# EAGLE design slider (EAGLE 9.5.2)
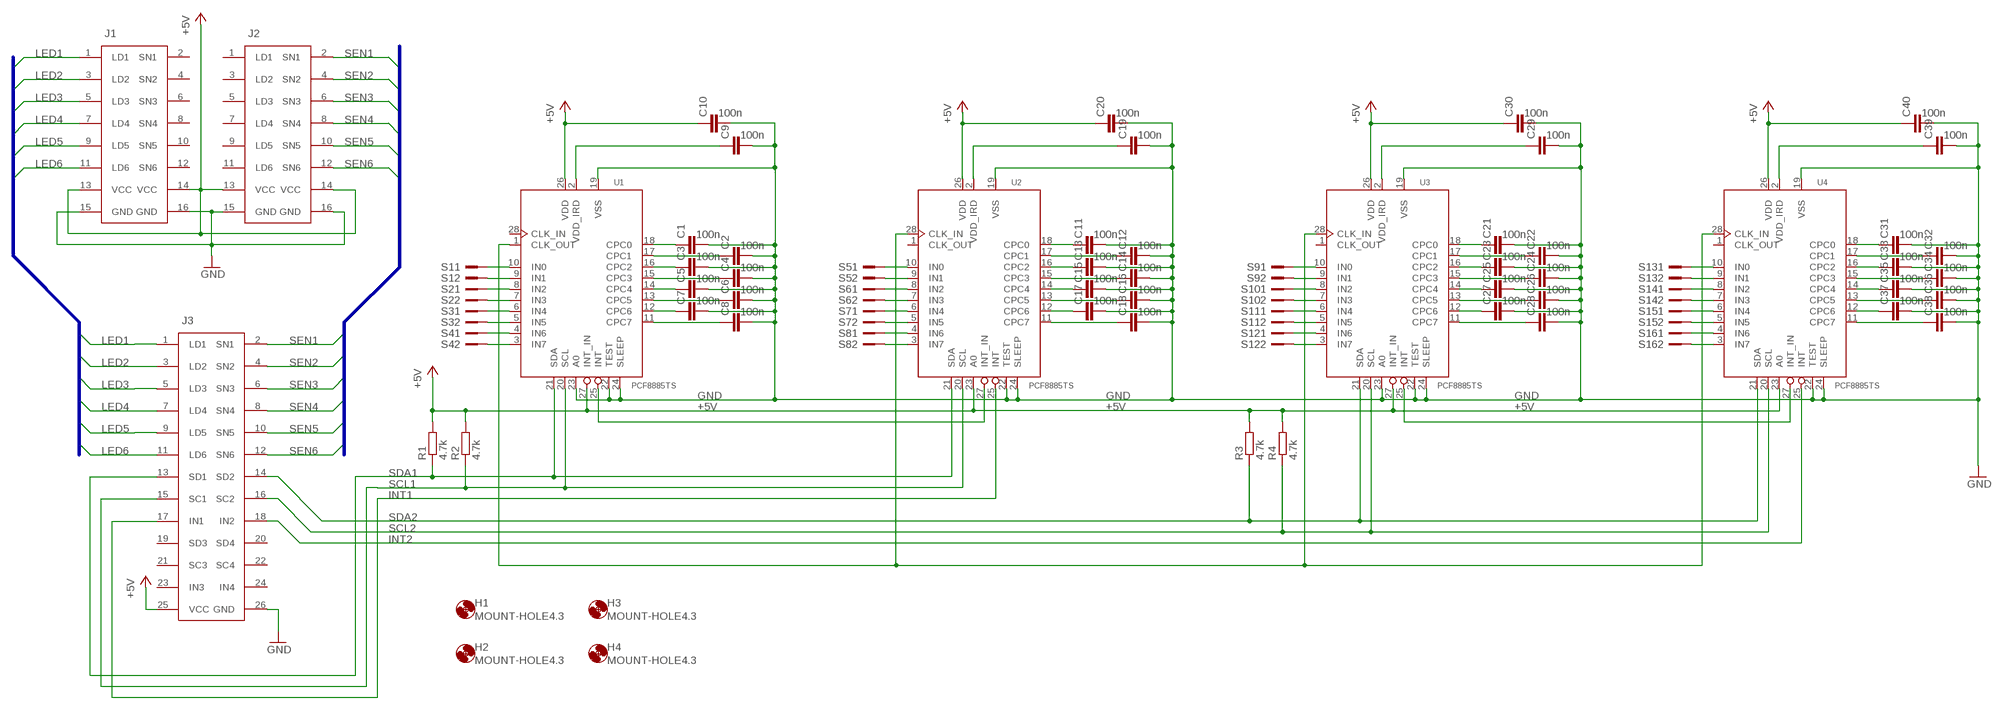
[diagram p0: schematic, sheet 1]

## Parts
C1  100n  C-EUC0603K  [C0603K]
C2  100n  C-EUC0603K  [C0603K]
C3  100n  C-EUC0603K  [C0603K]
C4  100n  C-EUC0603K  [C0603K]
C5  100n  C-EUC0603K  [C0603K]
C6  100n  C-EUC0603K  [C0603K]
C7  100n  C-EUC0603K  [C0603K]
C8  100n  C-EUC0603K  [C0603K]
C9  100n  C-EUC0603K  [C0603K]
C10  100n  C-EUC0603K  [C0603K]
C11  100n  C-EUC0603K  [C0603K]
C12  100n  C-EUC0603K  [C0603K]
C13  100n  C-EUC0603K  [C0603K]
C14  100n  C-EUC0603K  [C0603K]
C15  100n  C-EUC0603K  [C0603K]
C16  100n  C-EUC0603K  [C0603K]
C17  100n  C-EUC0603K  [C0603K]
C18  100n  C-EUC0603K  [C0603K]
C19  100n  C-EUC0603K  [C0603K]
C20  100n  C-EUC0603K  [C0603K]
C21  100n  C-EUC0603K  [C0603K]
C22  100n  C-EUC0603K  [C0603K]
C23  100n  C-EUC0603K  [C0603K]
C24  100n  C-EUC0603K  [C0603K]
C25  100n  C-EUC0603K  [C0603K]
C26  100n  C-EUC0603K  [C0603K]
C27  100n  C-EUC0603K  [C0603K]
C28  100n  C-EUC0603K  [C0603K]
C29  100n  C-EUC0603K  [C0603K]
C30  100n  C-EUC0603K  [C0603K]
C31  100n  C-EUC0603K  [C0603K]
C32  100n  C-EUC0603K  [C0603K]
C33  100n  C-EUC0603K  [C0603K]
C34  100n  C-EUC0603K  [C0603K]
C35  100n  C-EUC0603K  [C0603K]
C36  100n  C-EUC0603K  [C0603K]
C37  100n  C-EUC0603K  [C0603K]
C38  100n  C-EUC0603K  [C0603K]
C39  100n  C-EUC0603K  [C0603K]
C40  100n  C-EUC0603K  [C0603K]
H1  MOUNT-HOLE4.3  [4,3]
H2  MOUNT-HOLE4.3  [4,3]
H3  MOUNT-HOLE4.3  [4,3]
H4  MOUNT-HOLE4.3  [4,3]
J1  2516-SMD-AIR  [612X1620621]
J2  2516-SMD-AIR  [612X1620621]
J3  2526-SMD-MCU  [612X2620621]
R1  4.7k  R-EU_R0805  [R0805]
R2  4.7k  R-EU_R0805  [R0805]
R3  4.7k  R-EU_R0805  [R0805]
R4  4.7k  R-EU_R0805  [R0805]
S1  SENSPAD  [SENSPAD]
S2  SENSPAD  [SENSPAD]
S3  SENSPAD  [SENSPAD]
S4  SENSPAD  [SENSPAD]
S5  SENSPAD  [SENSPAD]
S6  SENSPAD  [SENSPAD]
S7  SENSPAD  [SENSPAD]
S8  SENSPAD  [SENSPAD]
S9  SENSPAD  [SENSPAD]
S10  SENSPAD  [SENSPAD]
S11  SENSPAD  [SENSPAD]
S12  SENSPAD  [SENSPAD]
S13  SENSPAD  [SENSPAD]
S14  SENSPAD  [SENSPAD]
S15  SENSPAD  [SENSPAD]
S16  SENSPAD  [SENSPAD]
U1  PCF8885TS  [SOT361-1]
U2  PCF8885TS  [SOT361-1]
U3  PCF8885TS  [SOT361-1]
U4  PCF8885TS  [SOT361-1]

## Nets
+5V: C10.1 C20.1 C30.1 C40.1 J1.13(VCC) J1.14(VCC) J2.13(VCC) J2.14(VCC) J3.25(VCC) R1.2 R2.2 R3.2 R4.2 U1.26(VDD) U1.27(INT_IN) U2.23(A0) U2.26(VDD) U3.26(VDD) U3.27(INT_IN) U4.23(A0) U4.26(VDD)
GND: C1.2 C2.2 C3.2 C4.2 C5.2 C6.2 C7.2 C8.2 C9.2 C10.2 C11.2 C12.2 C13.2 C14.2 C15.2 C16.2 C17.2 C18.2 C19.2 C20.2 C21.2 C22.2 C23.2 C24.2 C25.2 C26.2 C27.2 C28.2 C29.2 C30.2 C31.2 C32.2 C33.2 C34.2 C35.2 C36.2 C37.2 C38.2 C39.2 C40.2 J1.15(GND) J1.16(GND) J2.15(GND) J2.16(GND) J3.26(GND) U1.19(VSS) U1.22(TEST) U1.23(A0) U1.24(SLEEP) U2.19(VSS) U2.22(TEST) U2.24(SLEEP) U3.19(VSS) U3.22(TEST) U3.23(A0) U3.24(SLEEP) U4.19(VSS) U4.22(TEST) U4.24(SLEEP)
INT1: J3.17(IN1) U2.25(INT)
INT2: J3.18(IN2) U4.25(INT)
LED1: J1.1(LD1) J3.1(LD1)
LED2: J1.3(LD2) J3.3(LD2)
LED3: J1.5(LD3) J3.5(LD3)
LED4: J1.7(LD4) J3.7(LD4)
LED5: J1.9(LD5) J3.9(LD5)
LED6: J1.11(LD6) J3.11(LD6)
N$1: C1.1 U1.18(CPC0)
N$2: C2.1 U1.17(CPC1)
N$3: C3.1 U1.16(CPC2)
N$4: C4.1 U1.15(CPC3)
N$5: C5.1 U1.14(CPC4)
N$6: C6.1 U1.13(CPC5)
N$7: C7.1 U1.12(CPC6)
N$8: C8.1 U1.11(CPC7)
N$9: C11.1 U2.18(CPC0)
N$10: C9.1 U1.2(VDD_IRD)
N$11: C12.1 U2.17(CPC1)
N$12: C13.1 U2.16(CPC2)
N$13: C14.1 U2.15(CPC3)
N$14: C15.1 U2.14(CPC4)
N$15: C16.1 U2.13(CPC5)
N$16: C17.1 U2.12(CPC6)
N$17: C18.1 U2.11(CPC7)
N$18: C19.1 U2.2(VDD_IRD)
N$20: C21.1 U3.18(CPC0)
N$21: C22.1 U3.17(CPC1)
N$22: C23.1 U3.16(CPC2)
N$23: C24.1 U3.15(CPC3)
N$24: C25.1 U3.14(CPC4)
N$25: C26.1 U3.13(CPC5)
N$26: C27.1 U3.12(CPC6)
N$27: C28.1 U3.11(CPC7)
N$28: C29.1 U3.2(VDD_IRD)
N$29: C31.1 U4.18(CPC0)
N$30: C32.1 U4.17(CPC1)
N$31: C33.1 U4.16(CPC2)
N$32: C34.1 U4.15(CPC3)
N$33: C35.1 U4.14(CPC4)
N$34: C36.1 U4.13(CPC5)
N$35: C37.1 U4.12(CPC6)
N$36: C38.1 U4.11(CPC7)
N$37: C39.1 U4.2(VDD_IRD)
N$41: U1.1(CLK_OUT) U2.28(CLK_IN) U3.28(CLK_IN) U4.28(CLK_IN)
N$42: U1.25(INT) U2.27(INT_IN)
N$44: U3.25(INT) U4.27(INT_IN)
N$46: S13.1 U4.10(IN0)
N$47: S13.2 U4.9(IN1)
N$48: S14.1 U4.8(IN2)
N$49: S14.2 U4.7(IN3)
N$50: S15.1 U4.6(IN4)
N$51: S15.2 U4.5(IN5)
N$52: S16.1 U4.4(IN6)
N$53: S16.2 U4.3(IN7)
N$54: S9.1 U3.10(IN0)
N$55: S9.2 U3.9(IN1)
N$56: S10.1 U3.8(IN2)
N$57: S10.2 U3.7(IN3)
N$58: S11.1 U3.6(IN4)
N$59: S11.2 U3.5(IN5)
N$60: S12.1 U3.4(IN6)
N$61: S12.2 U3.3(IN7)
N$62: S5.1 U2.10(IN0)
N$63: S5.2 U2.9(IN1)
N$64: S6.1 U2.8(IN2)
N$65: S6.2 U2.7(IN3)
N$66: S7.1 U2.6(IN4)
N$67: S7.2 U2.5(IN5)
N$68: S8.1 U2.4(IN6)
N$69: S8.2 U2.3(IN7)
N$70: S1.1 U1.10(IN0)
N$71: S1.2 U1.9(IN1)
N$72: S2.1 U1.8(IN2)
N$73: S2.2 U1.7(IN3)
N$74: S3.1 U1.6(IN4)
N$75: S3.2 U1.5(IN5)
N$76: S4.1 U1.4(IN6)
N$77: S4.2 U1.3(IN7)
SCL1: J3.15(SC1) R2.1 U1.20(SCL) U2.20(SCL)
SCL2: J3.16(SC2) R4.1 U3.20(SCL) U4.20(SCL)
SDA1: J3.13(SD1) R1.1 U1.21(SDA) U2.21(SDA)
SDA2: J3.14(SD2) R3.1 U3.21(SDA) U4.21(SDA)
SEN1: J2.2(SN1) J3.2(SN1)
SEN2: J2.4(SN2) J3.4(SN2)
SEN3: J2.6(SN3) J3.6(SN3)
SEN4: J2.8(SN4) J3.8(SN4)
SEN5: J2.10(SN5) J3.10(SN5)
SEN6: J2.12(SN6) J3.12(SN6)
Unconnected: J1.2(SN1) J1.4(SN2) J1.6(SN3) J1.8(SN4) J1.10(SN5) J1.12(SN6) J2.1(LD1) J2.3(LD2) J2.5(LD3) J2.7(LD4) J2.9(LD5) J2.11(LD6) J3.19(SD3) J3.20(SD4) J3.21(SC3) J3.22(SC4) J3.23(IN3) J3.24(IN4) U1.28(CLK_IN) U2.1(CLK_OUT) U3.1(CLK_OUT) U4.1(CLK_OUT)

## Buses
SEN[1..6]
LED[1..6]

## Library data of the parts
C1-C40 = chuni:C-EU: CAPACITOR, European symbol; SPICEPREFIX: C
H1-H4 = chuni:MOUNT-HOLE: MOUNTING HOLE with drill center marker
J1 J2 = chuni:2516-SMD-AIR: WR-BHD 2.54mm Male SMT Box Header High Temperature, 16 Pins=>Code : Con_WTB_BHD_2.54_Male_SMT_612X1620621(X=0;X=3) <http://katalog.we-online.de/media/thumbs2/eican/thb_Con_WTB_BHD_2.54_Male_SMT_6120xx20621_pf2.jpg> 6123XX20621: http://katalog.we-online.de/en/em/BHD_2_54_SMT_MALE_BOX_HEADER_REEL_6123XX20621 6120XX20621: http://katalog.we-online.de/en/em/612_0xx_206_21 Created 2014-06-05, Karrer Zheng 2014 (C) Würth Elektronik
J3 = chuni:2526-SMD-MCU: WR-BHD 2.54mm Male SMT Box Header High Temperature, 26 Pins=>Code : Con_WTB_BHD_2.54_Male_SMT_612X2620621(X=0;X=3) <http://katalog.we-online.de/media/thumbs2/eican/thb_Con_WTB_BHD_2.54_Male_SMT_6120xx20621_pf2.jpg> 6123XX20621: http://katalog.we-online.de/en/em/BHD_2_54_SMT_MALE_BOX_HEADER_REEL_6123XX20621 6120XX20621: http://katalog.we-online.de/en/em/612_0xx_206_21 Created 2014-06-05, Karrer Zheng 2014 (C) Würth Elektronik
R1-R4 = chuni:R-EU_: RESISTOR, European symbol; SPICEPREFIX: R
S1-S16 = chuni:SENSPAD
U1-U4 = chuni:PCF8885: NXP Capacitive 8-channel proximity switch with auto-calibration and very low power consumption AAL Eindhoven MK

## Board
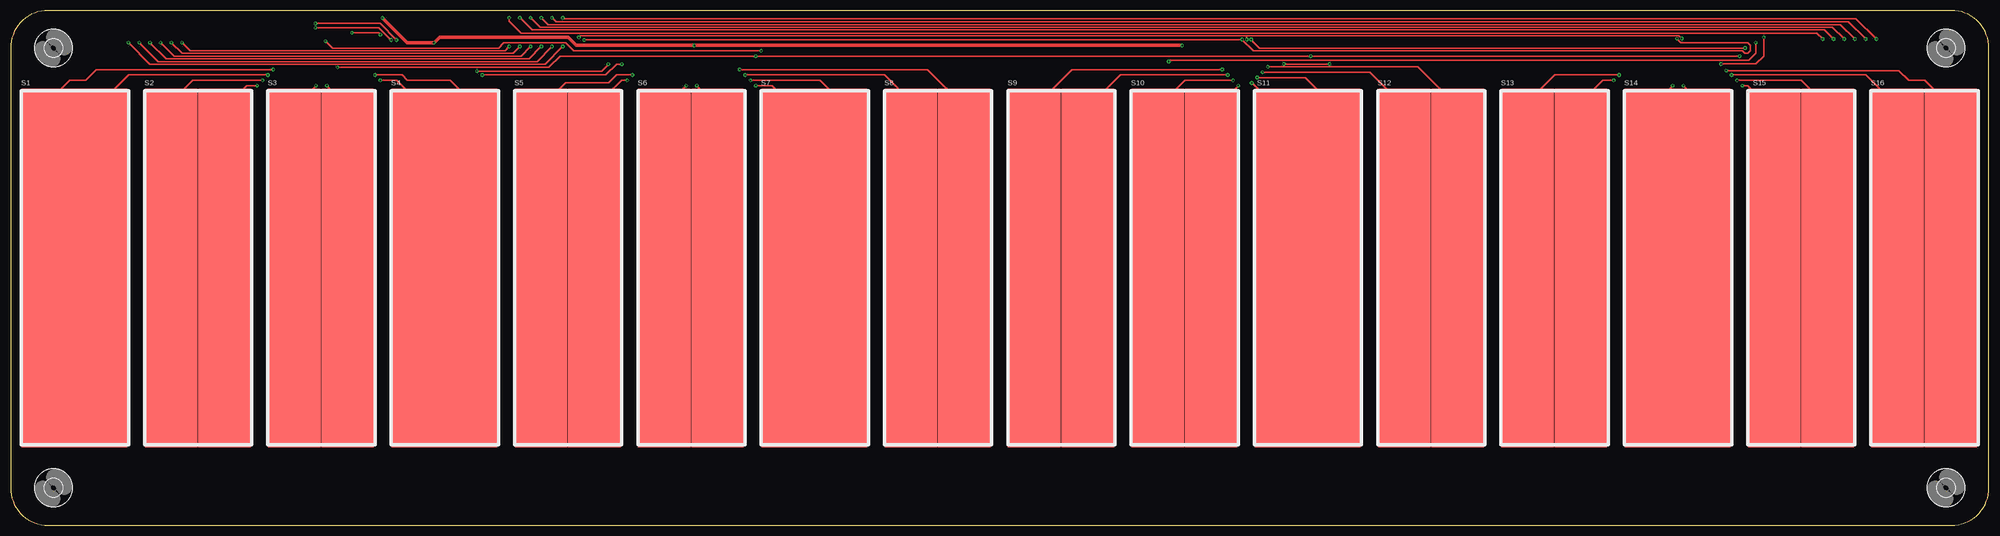
[diagram p1: board, top side]
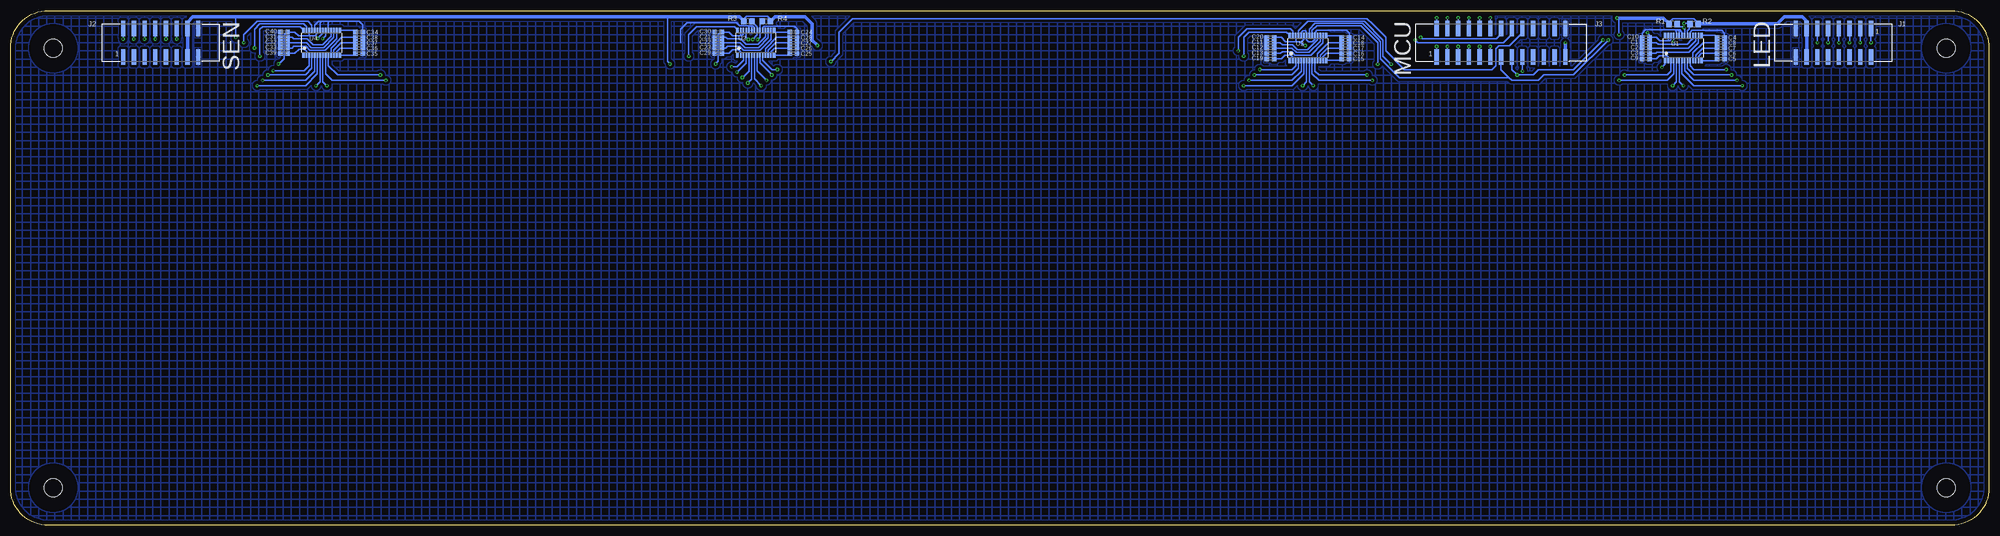
[diagram p2: board, bottom side, seen from below]

Size 468.63 x 121.92 mm. Coordinates in mm from the lower left corner, seen from the top.
Outline: 0,17.78 0,8.89 arc90 8.89,0 459.74,0 arc90 468.63,8.89 468.63,19.05 468.63,113.03 arc90 459.74,121.92 8.89,121.92 arc90 0,113.03 0,97.79 0,17.78
Copper layers (1*16): Top 0.035mm / dielectric 1.5mm / Bottom 0.035mm
Design rules "default": minimum track width 6mil, minimum drill 0.35mm, track to track 6mil, track to pad 6mil, pad to pad 6mil, via to via 6mil, smd to smd 6mil, copper to edge 40mil, drill to drill 6mil, minimum pad ring 10mil, minimum via ring 8mil, stop-mask expansion 4mil, vias tented up to drill 0mil, thermal gap 10mil

### Footprints (pad centres in the part's own frame; a part is rotated, then mirrored left to right if it is on the bottom)
C0603K = smd 1.05 x 1.08: 1 -0.875,0; 2 0.875,0
4,3 = hole 4.3: 0,0
612X1620621 = smd 1 x 3.75: 1 -8.89,-3.375; 2 -8.89,3.375; 3 -6.35,-3.375; 4 -6.35,3.375; 5 -3.81,-3.375; 6 -3.81,3.375; 7 -1.27,-3.375; 8 -1.27,3.375; 9 1.27,-3.375; 10 1.27,3.375; 11 3.81,-3.375; 12 3.81,3.375; 13 6.35,-3.375; 14 6.35,3.375; 15 8.89,-3.375; 16 8.89,3.375
612X2620621 = smd 1 x 3.75: 1 -15.24,-3.375; 2 -15.24,3.375; 3 -12.7,-3.375; 4 -12.7,3.375; 5 -10.16,-3.375; 6 -10.16,3.375; 7 -7.62,-3.375; 8 -7.62,3.375; 9 -5.08,-3.375; 10 -5.08,3.375; 11 -2.54,-3.375; 12 -2.54,3.375; 13 0,-3.375; 14 0,3.375; 15 2.54,-3.375; 16 2.54,3.375; 17 5.08,-3.375; 18 5.08,3.375; 19 7.62,-3.375; 20 7.62,3.375; 21 10.16,-3.375; 22 10.16,3.375; 23 12.7,-3.375; 24 12.7,3.375; 25 15.24,-3.375; 26 15.24,3.375
R0805 = smd 1.3 x 1.5: 1 -0.95,0; 2 0.95,0
SENSPAD = smd 12.4 x 85: 1 -6.4,0; 2 6.2,0
SOT361-1 = smd 0.6 x 1.35: 1 -4.325,-2.925; 14 4.325,-2.925; 15 4.325,2.925; 28 -4.325,2.925 | smd 0.4 x 1.35: 2 -3.575,-2.925; 3 -2.925,-2.925; 4 -2.275,-2.925; 5 -1.625,-2.925; 6 -0.975,-2.925; 7 -0.325,-2.925; 8 0.325,-2.925; 9 0.975,-2.925; 10 1.625,-2.925; 11 2.275,-2.925; 12 2.925,-2.925; 13 3.575,-2.925; 16 3.575,2.925; 17 2.925,2.925; 18 2.275,2.925; 19 1.625,2.925; 20 0.975,2.925; 21 0.325,2.925; 22 -0.325,2.925; 23 -0.975,2.925; 24 -1.625,2.925; 25 -2.275,2.925; 26 -2.925,2.925; 27 -3.575,2.925

### Placement (x,y rotation side)
C1  81.28,114.3 180 bottom
C2  81.28,113.03 180 bottom
C3  81.28,111.76 180 bottom
C4  63.5,115.57 0 bottom
C5  63.5,110.49 0 bottom
C6  63.5,111.76 0 bottom
C7  63.5,113.03 0 bottom
C8  63.5,114.3 0 bottom
C9  81.28,110.49 180 bottom
C10  81.28,115.57 180 bottom
C11  170.18,114.3 180 bottom
C12  170.18,113.03 180 bottom
C13  170.18,111.76 180 bottom
C14  152.4,115.57 0 bottom
C15  152.4,110.49 0 bottom
C16  152.4,111.76 0 bottom
C17  152.4,113.03 0 bottom
C18  152.4,114.3 0 bottom
C19  170.18,110.49 180 bottom
C20  170.18,115.57 180 bottom
C21  300.99,115.57 180 bottom
C22  300.99,114.3 180 bottom
C23  300.99,113.03 180 bottom
C24  283.21,116.84 0 bottom
C25  283.21,111.76 0 bottom
C26  283.21,113.03 0 bottom
C27  283.21,114.3 0 bottom
C28  283.21,115.57 0 bottom
C29  300.99,111.76 180 bottom
C30  300.99,116.84 180 bottom
C31  403.86,115.57 180 bottom
C32  403.86,114.3 180 bottom
C33  403.86,113.03 180 bottom
C34  386.08,116.84 0 bottom
C35  386.08,111.76 0 bottom
C36  386.08,113.03 0 bottom
C37  386.08,114.3 0 bottom
C38  386.08,115.57 0 bottom
C39  403.86,111.76 180 bottom
C40  403.86,116.84 180 bottom
H1  10.16,8.89 0 top
H2  458.47,8.89 0 top
H3  10.16,113.03 0 top
H4  458.47,113.03 0 top
J1  36.83,114.3 180 bottom
J2  433.07,114.3 0 bottom
J3  115.57,114.3 0 bottom
R1  74.8,118.75 180 bottom
R2  69.85,118.75 0 bottom
R3  294,119.38 180 bottom
R4  289.56,119.38 0 bottom
S1  15.24,60.96 0 top
S2  44.45,60.96 0 top
S3  73.66,60.96 0 top
S4  102.87,60.96 0 top
S5  132.08,60.96 0 top
S6  161.29,60.96 0 top
S7  190.5,60.96 0 top
S8  219.71,60.96 0 top
S9  248.92,60.96 0 top
S10  278.13,60.96 0 top
S11  307.34,60.96 0 top
S12  336.55,60.96 0 top
S13  365.76,60.96 0 top
S14  394.97,60.96 0 top
S15  424.18,60.96 0 top
S16  453.39,60.96 0 top
U1  72.39,113.03 0 bottom
U2  161.29,113.03 0 bottom
U3  292.1,114.3 0 bottom
U4  394.97,114.3 0 bottom

### Tracks (layer width: path | path; a pad name or v marks a point on that pad's centre or on a via)
+5V  (via drill 0.35)
  Top 0.305: v405.13,109.27 413.43,109.27 415.29,111.12 v415.29,115.57 | v301.62,109.27 301.67,109.22 312.42,109.22 v312.42,109.27 | v80.9,116.67 87.17,116.67 v87.63,116.2
  Top 0.813: v277.5,113.67 v161.92,113.67 133.98,113.67 132.08,115.57 101.6,115.57 v100.33,114.3 93.98,114.3 v88.14,120.14
  Bottom 0.305: U1.26 75.32,115.06 75.57,114.81 75.95,114.81 | 75.95,114.81 77.98,114.81 78.74,115.57 C10.1 80.41,116.17 v80.9,116.67 | U1.27 75.97,114.83 75.95,114.81 | U2.23 162.26,115.1 162.81,114.55 163.19,114.55 | 164.21,114.55 163.19,114.55 | 164.21,114.55 166.62,114.55 167.64,115.57 C20.1 | U2.26 164.22,114.56 164.21,114.55 | U3.26 295.03,116.45 295.53,115.95 295.66,115.95 | 295.66,115.95 297.56,115.95 298.45,116.84 C30.1 300.36,116.84 300.99,116.2 300.99,109.9 v301.62,109.27 | U3.27 295.68,115.97 295.66,115.95 | U4.23 395.94,116.5 396.49,115.95 397.89,115.95 | 397.89,115.95 400.43,115.95 401.32,116.84 C40.1 403.23,116.84 403.86,116.2 403.86,110.49 405.11,109.24 v405.13,109.27 | U4.26 397.9,115.95 397.89,115.95 | 163.19,114.55 162.31,113.67 v161.92,113.67 | v415.29,115.57 415.29,120.42 | v312.42,109.27 313.06,109.9 313.06,120.42 | v87.63,116.2 87.63,120.14
  Bottom 0.406: R3.2 294.96,119.89 294.23,120.61 289.33,120.61 288.61,119.89 R4.2 | R1.2 75.75,119.19 74.93,120.02 69.85,120.02 68.9,119.06 R2.2
  Bottom 0.813: J2.13 J2.14 426.72,119.15 425.45,120.42 415.29,120.42 396.24,120.42 313.06,120.42 295.91,120.42 294.96,119.47 R3.2 | R4.2 287.57,120.42 280.44,120.42 278.77,118.75 278.77,114.94 v277.5,113.67 | v100.33,114.3 J3.25 | R1.2 77.15,120.14 87.63,120.14 v88.14,120.14 | R2.2 50.16,118.75 48.49,120.42 44.22,120.42 43.18,119.38 J1.13 J1.14
GND
  Bottom 0.305: U4.24 396.6,118.39 395.61,119.38 394.97,119.38 | 394.97,119.38 393.06,119.38 | 393.06,119.38 386.08,119.38 385.21,118.5 C34.2 | U4.22 395.3,119.06 394.97,119.38 | U4.19 393.35,119.1 393.06,119.38 | U3.22 292.43,117.89 292.86,118.33 293.37,118.33 | 293.37,118.33 294,118.33 | 294,118.33 295.99,118.33 296.66,119 301.62,119 308.36,119 309.88,117.47 309.88,114.3 | U3.23 293.08,118.03 293.37,118.33 | U3.24 293.73,118.05 294,118.33 | U3.19 290.48,117.88 290.12,118.24 282.96,118.24 282.32,117.6 282.32,116.85 C24.2 | U1.19 70.77,116.81 70.36,117.22 63.25,117.22 62.62,116.6 C4.2 | U1.22 72.72,116.78 73.28,117.35 73.66,117.35 | 73.66,117.35 74.3,117.35 | 74.3,117.35 81.41,117.35 82.16,116.6 C10.2 | U1.23 73.37,117.05 73.66,117.35 | U1.24 74.02,117.07 74.3,117.35 | U2.24 162.91,116.74 162.56,117.09 161.92,117.09 161.61,116.78 U2.22 161.61,115.01 161.16,114.55 160.27,114.55 159.66,115.16 U2.19 159.66,116.69 159.13,117.22 152.15,117.22 151.53,116.6 C14.2
  pour Bottom (isolate 0.61, hatched): 6.35,125.73 -1.27,118.11 -1.27,5.08 5.71,-1.9 464.82,-1.9 471.17,4.45 471.17,116.84 462.28,125.73
INT1  (via drill 0.35)
  Top 0.305: v141.6,109.22 139.95,107.57 v110.49,107.57
  Bottom 0.305: J3.17 v110.49,107.57 | U2.25 163.56,117.11 161.29,119.38 147.95,119.38 143.51,114.94 143.51,111.12 v141.6,109.22
INT2  (via drill 0.35)
  Top 0.305: v274.32,109.86 274.57,110.11 411.73,110.11 413.39,111.76 v413.39,114.3
  Bottom 0.305: J3.18 110.49,116.71 113.6,113.6 116.14,113.6 116.84,112.9 116.84,108.84 117.73,107.95 138.43,107.95 142.88,112.39 142.88,115.57 146.05,118.75 147.32,120.02 269.24,120.02 272.42,116.84 272.42,111.76 v274.32,109.86 | v413.39,114.3 413.39,116.2 410.21,119.38 398.15,119.38 397.25,118.48 U4.25
LED1  (via drill 0.35)
  Top 0.305: v27.94,114.3 33.02,109.22 126.62,109.22 v130.81,113.41
  Bottom 0.305: J1.1 v27.94,114.3 | v130.81,113.41 J3.1
LED2  (via drill 0.35)
  Top 0.305: v30.48,114.3 34.92,109.86 98.43,109.86 124.71,109.86 v128.27,113.41
  Bottom 0.305: J1.3 v30.48,114.3 | v128.27,113.41 J3.3
LED3  (via drill 0.35)
  Top 0.305: v33.02,114.3 36.83,110.49 122.81,110.49 v125.73,113.41
  Bottom 0.305: J1.5 v33.02,114.3 | v125.73,113.41 J3.5
LED4  (via drill 0.35)
  Top 0.305: v35.56,114.3 38.73,111.12 120.9,111.12 v123.19,113.41
  Bottom 0.305: J1.7 v35.56,114.3 | v123.19,113.41 J3.7
LED5  (via drill 0.35)
  Top 0.305: v38.1,114.3 40.64,111.76 100.33,111.76 119,111.76 v120.65,113.41
  Bottom 0.305: J1.9 v38.1,114.3 | v120.65,113.41 J3.9
LED6  (via drill 0.35)
  Top 0.305: v40.64,114.3 42.55,112.39 117.09,112.39 v118.11,113.41
  Bottom 0.305: J1.11 v40.64,114.3 | v118.11,113.41 J3.11
N$1
  Bottom 0.305: U1.18 70.12,115.3 70.44,114.97 70.45,114.97 71.5,113.92 78.36,113.92 78.74,114.3 C1.1
N$2
  Bottom 0.305: C2.1 71.23,113.03 69.47,114.79 U1.17
N$3
  Bottom 0.305: U1.16 68.82,114.28 71.08,112.01 78.63,112.01 78.88,111.76 C3.1
N$4
  Bottom 0.305: U1.15 68.07,116.08 64.88,116.08 C4.1
N$5
  Bottom 0.305: U1.14 68.07,109.98 64.88,109.98 C5.1
N$6
  Bottom 0.305: U1.13 68.82,111.02 68.07,111.76 C6.1
N$7
  Bottom 0.305: U1.12 69.47,111.38 67.82,113.03 C7.1
N$8
  Bottom 0.305: U1.11 70.12,111.88 67.69,114.3 C8.1
N$9
  Bottom 0.305: U2.18 159.01,115.05 161.41,112.65 163.83,112.65 164.97,113.79 167.4,113.79 167.91,114.3 C11.1
N$10
  Bottom 0.305: U1.2 75.97,110.81 76.33,111.18 78.05,111.18 78.74,110.49 C9.1
N$11
  Bottom 0.305: U2.17 158.36,114.69 161.04,112.01 164.08,112.01 165.1,113.03 C12.1
N$12
  Bottom 0.305: U2.16 157.72,114.32 160.66,111.38 164.34,111.38 165.1,112.14 167.4,112.14 167.78,111.76 C13.1
N$13
  Bottom 0.305: U2.15 153.66,115.95 C14.1
N$14
  Bottom 0.305: U2.14 153.66,110.11 C15.1
N$15
  Bottom 0.305: U2.13 157.72,111.02 156.97,111.76 C16.1
N$16
  Bottom 0.305: U2.12 158.36,111.38 156.72,113.03 C17.1
N$17
  Bottom 0.305: U2.11 159.01,111.75 156.46,114.3 C18.1
N$18
  Bottom 0.305: U2.2 164.86,110.89 165.35,111.38 166.37,111.38 | 166.37,111.38 166.75,111.38 | C19.1 167.64,110.49 166.75,111.38 | 166.37,111.38 166.75,111.38
N$20
  Bottom 0.305: U3.18 289.83,115.68 291.59,113.92 294.39,113.92 295.66,115.19 298.85,115.19 299.23,115.57 C21.1
N$21
  Bottom 0.305: C22.1 295.78,114.3 294.64,113.16 291.47,113.16 289.18,115.45 U3.17
N$22
  Bottom 0.305: C23.1 299.23,113.03 298.85,113.41 295.91,113.41 295.02,112.52 291.08,112.52 289.31,114.3 288.53,115.08 U3.16
N$23
  Bottom 0.305: U3.15 287.39,116.84 C24.1
N$24
  Bottom 0.305: U3.14 284.47,111.38 C25.1
N$25
  Bottom 0.305: U3.13 288.53,112.16 287.66,113.03 C26.1
N$26
  Bottom 0.305: U3.12 289.18,112.53 287.4,114.3 C27.1
N$27
  Bottom 0.305: U3.11 289.83,112.89 287.15,115.57 C28.1
N$28
  Bottom 0.305: U3.2 295.68,112.16 296.16,112.65 297.56,112.65 298.45,111.76 C29.1
N$29
  Bottom 0.305: U4.18 392.69,115.81 394.71,113.79 397,113.79 398.4,115.19 401.59,115.19 401.97,115.57 C31.1
N$30
  Bottom 0.305: C32.1 398.53,114.3 397.38,113.16 394.46,113.16 392.05,115.57 U4.17
N$31
  Bottom 0.305: C33.1 401.97,113.03 401.59,113.41 398.65,113.41 397.76,112.52 394.08,112.52 391.4,115.21 U4.16
N$32
  Bottom 0.305: U4.15 387.34,117.22 C34.1
N$33
  Bottom 0.305: U4.14 387.34,111.38 C35.1
N$34
  Bottom 0.305: U4.13 391.4,112.16 390.53,113.03 C36.1
N$35
  Bottom 0.305: U4.12 392.05,112.53 390.27,114.3 C37.1
N$36
  Bottom 0.305: U4.11 392.69,113.02 390.14,115.57 C38.1
N$37
  Bottom 0.305: U4.2 398.55,112.29 399.03,112.78 400.3,112.78 401.32,111.76 C39.1
N$41  (via drill 0.35)
  Top 0.305: v77.47,108.46 127.51,108.46 130.18,111.12 v176.53,111.12 v307.98,111.12 v409.58,111.12
  Bottom 0.305: U1.1 76.72,109.21 v77.47,108.46 | U4.28 399.3,117.36 400.05,118.11 408.94,118.11 409.58,117.47 v409.58,111.12 | U3.28 296.43,117.36 297.18,118.11 306.07,118.11 307.98,116.2 v307.98,111.12 | 165.61,116.09 U2.28 165.61,116.09 | 165.61,116.09 166.37,116.84 175.26,116.84 176.53,115.57 v176.53,111.12
N$42  (via drill 0.35)
  Top 0.305: v177.8,112.39 133.35,112.39 131.44,114.3 118.11,114.3 116.84,114.3 115.57,113.03 76.28,113.03 v74.63,114.68
  Bottom 0.305: U2.27 164.86,116.99 165.48,117.6 175.77,117.6 177.8,115.57 v177.8,112.39 | U1.25 74.67,114.71 v74.63,114.68
N$44  (via drill 0.35)
  Top 0.305: v410.85,113.03 407.67,113.03 295.78,113.03 293.88,114.94 v293.88,115.06
  Bottom 0.305: U4.27 398.55,118.13 399.16,118.75 409.58,118.75 410.85,117.47 v410.85,113.03 | U3.25 294.38,115.57 294.38,115.56 v293.88,115.06
N$46  (via drill 0.35)
  Top 0.305: S13.1 359.36,100.28 365.76,106.68 v381,106.68
  Bottom 0.305: U4.10 393.35,108.86 391.16,106.68 v381,106.68
N$47  (via drill 0.35)
  Top 0.305: S13.2 371.96,100.18 377.19,105.41 v379.73,105.41
  Bottom 0.305: U4.9 394,106.97 392.43,105.41 v379.73,105.41
N$48  (via drill 0.35)
  Top 0.305: S14.1 388.57,99.01 v393.7,104.14
  Bottom 0.305: U4.8 394.65,105.09 v393.7,104.14
N$49  (via drill 0.35)
  Top 0.305: S14.2 401.17,99.21 v396.24,104.14
  Bottom 0.305: U4.7 395.3,105.09 v396.24,104.14
N$50  (via drill 0.35)
  Top 0.305: S15.1 417.78,97.84 411.48,104.14 v410.21,104.14
  Bottom 0.305: U4.6 395.94,106.97 398.78,104.14 v410.21,104.14
N$51  (via drill 0.35)
  Top 0.305: S15.2 430.38,99.21 424.18,105.41 v408.94,105.41
  Bottom 0.305: U4.5 396.6,107.59 398.78,105.41 v408.94,105.41
N$52  (via drill 0.35)
  Top 0.305: S16.1 446.99,99.11 439.42,106.68 v407.67,106.68
  Bottom 0.305: U4.4 397.25,108.22 398.78,106.68 v407.67,106.68
N$53  (via drill 0.35)
  Top 0.305: S16.2 459.59,99.21 453.39,105.41 449.58,105.41 447.29,107.7 v406.4,107.7
  Bottom 0.305: U4.3 397.9,108.84 399.03,107.7 v406.4,107.7
N$54  (via drill 0.35)
  Top 0.305: S9.1 242.52,99.01 251.46,107.95 v287.02,107.95
  Bottom 0.305: U3.10 290.48,110.14 288.29,107.95 v287.02,107.95
N$55  (via drill 0.35)
  Top 0.305: S9.2 255.12,98.91 262.89,106.68 v288.29,106.68
  Bottom 0.305: U3.9 291.12,109.52 v288.29,106.68
N$56  (via drill 0.35)
  Top 0.305: S10.1 271.73,99.01 278.13,105.41 v289.56,105.41
  Bottom 0.305: U3.8 291.78,107.62 v289.56,105.41
N$57  (via drill 0.35)
  Top 0.305: S10.2 284.33,97.64 v290.83,104.14
  Bottom 0.305: U3.7 292.43,105.73 v290.83,104.14
N$58  (via drill 0.35)
  Top 0.305: S11.1 300.94,97.84 v294,104.78
  Bottom 0.305: U3.6 293.08,105.7 v294,104.78
N$59  (via drill 0.35)
  Top 0.305: S11.2 313.54,99.21 306.71,106.05 v295.28,106.05
  Bottom 0.305: U3.5 293.73,107.59 v295.28,106.05
N$60  (via drill 0.35)
  Top 0.305: S12.1 330.15,99.11 321.94,107.31 v296.55,107.31
  Bottom 0.305: U3.4 294.38,109.48 v296.55,107.31
N$61  (via drill 0.35)
  Top 0.305: S12.2 342.75,99.21 333.38,108.59 v297.81,108.59
  Bottom 0.305: U3.3 295.03,110.11 296.55,108.59 v297.81,108.59
N$62  (via drill 0.35)
  Top 0.305: S5.1 125.68,99.01 131.44,104.78 141.6,104.78 143.51,106.68 v147.32,106.68
  Bottom 0.305: U2.10 159.66,107.59 158.75,106.68 v147.32,106.68
N$63  (via drill 0.35)
  Top 0.305: S5.2 138.28,98.91 144.78,105.41 v146.05,105.41
  Bottom 0.305: U2.9 160.31,106.97 158.75,105.41 v146.05,105.41
N$64  (via drill 0.35)
  Top 0.305: S6.1 154.89,99.01 v160.02,104.14
  Bottom 0.305: U2.8 160.97,105.09 v160.02,104.14
N$65  (via drill 0.35)
  Top 0.305: S6.2 167.49,99.21 v162.56,104.14
  Bottom 0.305: U2.7 161.61,105.09 v162.56,104.14
N$66  (via drill 0.35)
  Top 0.305: S7.1 184.1,100.38 180.34,104.14 v176.53,104.14
  Bottom 0.305: U2.6 162.26,106.97 165.1,104.14 v176.53,104.14
N$67  (via drill 0.35)
  Top 0.305: S7.2 196.7,100.48 191.77,105.41 v175.26,105.41
  Bottom 0.305: U2.5 162.91,107.59 165.1,105.41 v175.26,105.41
N$68  (via drill 0.35)
  Top 0.305: S8.1 213.31,100.38 207.01,106.68 v173.99,106.68
  Bottom 0.305: U2.4 163.56,108.22 165.1,106.68 v173.99,106.68
N$69  (via drill 0.35)
  Top 0.305: S8.2 225.91,99.21 217.17,107.95 v172.72,107.95
  Bottom 0.305: U2.3 164.22,108.84 165.1,107.95 v172.72,107.95
N$70  (via drill 0.35)
  Top 0.305: S1.1 8.84,100.28 13.97,105.41 17.78,105.41 20.32,107.95 v62.23,107.95
  Bottom 0.305: U1.10 70.77,108.86 69.85,107.95 v62.23,107.95
N$71  (via drill 0.35)
  Top 0.305: S1.2 21.44,100.18 27.94,106.68 v60.96,106.68
  Bottom 0.305: U1.9 71.42,108.25 69.85,106.68 v60.96,106.68
N$72  (via drill 0.35)
  Top 0.305: S2.1 38.05,100.28 43.18,105.41 v59.69,105.41
  Bottom 0.305: U1.8 72.07,107.62 69.85,105.41 v59.69,105.41
N$73  (via drill 0.35)
  Top 0.305: v58.42,104.14 55.88,104.14 50.65,98.91 S2.2
  Bottom 0.305: U1.7 72.72,107 69.85,104.14 v58.42,104.14
N$74  (via drill 0.35)
  Top 0.305: S3.1 67.26,59.74 67.31,59.69 67.31,99.06 v72.39,104.14
  Bottom 0.305: U1.6 73.37,105.11 v72.39,104.14
N$75  (via drill 0.35)
  Top 0.305: S3.2 79.86,99.21 v74.93,104.14
  Bottom 0.305: U1.5 74.02,105.06 v74.93,104.14
N$76  (via drill 0.35)
  Top 0.305: v87.63,105.41 91.44,105.41 96.47,100.38 S4.1
  Bottom 0.305: v87.63,105.41 76.2,105.41 74.67,106.95 U1.4
N$77  (via drill 0.35)
  Top 0.305: v86.36,106.68 92.71,106.68 93.98,105.41 104.14,105.41 105.41,104.14 109.07,100.48 S4.2
  Bottom 0.305: U1.3 75.32,107.56 76.2,106.68 v86.36,106.68
SCL1  (via drill 0.35)
  Top 0.305: v144.78,109.22 143.51,109.22 140.97,106.68 v111.76,106.68 | v72.26,118.87 87.5,118.87 v91.44,114.94
  Bottom 0.305: v91.44,114.94 98.43,107.95 106.68,107.95 107.95,106.68 v111.76,106.68 113.03,107.95 J3.15 | U2.20 160.31,117.25 159.23,118.33 148.81,118.33 144.78,114.3 v144.78,109.22 | R2.1 70.93,118.87 | v72.26,118.87 70.93,118.87 | U1.20 71.42,117.18 70.93,117.67 70.93,118.87
SCL2  (via drill 0.35)
  Top 0.305: v394.72,115.27 395.68,114.3 396.88,114.3 411.48,114.3 412.12,113.67 412.12,112.39 411.48,111.76 410.85,111.76 410.21,112.39 294.39,112.39 v291.72,115.06 136.02,115.06 v135.89,114.94
  Bottom 0.305: J3.16 113.03,116.33 115.06,114.3 121.92,114.3 130.81,114.3 135.25,114.3 v135.89,114.94 | R4.1 291.12,118.77 291.12,118.24 U3.20 291.12,116.2 291.12,115.66 v291.72,115.06 | U4.20 394,115.99 v394.72,115.27
SDA1  (via drill 0.35)
  Top 0.305: v72.26,117.86 87.25,117.86 v90.17,114.94
  Bottom 0.305: J3.13 115.57,107.95 113.67,106.05 | v90.17,114.94 98.43,106.68 105.41,106.68 106.68,105.41 113.03,105.41 113.67,106.05 | U1.21 72.07,116.84 72.07,117.66 v72.26,117.86 72.52,118.11 73.22,118.11 R1.1 | U2.21 160.97,117.55 159.64,118.87 148.45,118.87 144.65,115.07 144.14,114.57 144.14,110.49 139.7,106.05 113.67,106.05
SDA2  (via drill 0.35)
  Top 0.305: v134.62,115.57 135,115.95 290.83,115.95 292.74,115.95 | v395.86,115.32 395.22,115.95 292.74,115.95 | v292.86,115.06 292.74,115.19 292.74,115.95
  Bottom 0.305: J3.14 115.57,116.33 116.71,115.19 134.24,115.19 v134.62,115.57 | R3.1 291.78,118.1 U3.21 291.78,116.15 v292.86,115.06 | v395.86,115.32 394.65,116.53 U4.21
SEN1  (via drill 0.35)
  Top 0.305: v130.81,120.2 130.99,120.02 437.13,120.02 v441.96,115.19
  Bottom 0.305: J3.2 v130.81,120.2 | v441.96,115.19 J2.2
SEN2  (via drill 0.35)
  Top 0.305: v128.27,120.2 129.21,119.25 435.36,119.25 v439.42,115.19
  Bottom 0.305: J3.4 v128.27,120.2 | v439.42,115.19 J2.4
SEN3  (via drill 0.35)
  Top 0.305: v125.73,120.2 127.31,118.62 433.45,118.62 v436.88,115.19
  Bottom 0.305: J3.6 v125.73,120.2 | v436.88,115.19 J2.6
SEN4  (via drill 0.35)
  Top 0.305: v123.19,120.2 125.4,117.98 431.55,117.98 v434.34,115.19
  Bottom 0.305: J3.8 v123.19,120.2 | v434.34,115.19 J2.8
SEN5  (via drill 0.35)
  Top 0.305: v120.65,120.2 123.5,117.35 429.64,117.35 v431.8,115.19
  Bottom 0.305: J3.10 v120.65,120.2 | v431.8,115.19 J2.10
SEN6  (via drill 0.35)
  Top 0.305: v118.11,120.2 118.11,119.38 120.9,116.59 427.86,116.59 v429.26,115.19
  Bottom 0.305: J3.12 v118.11,120.2 | v429.26,115.19 J2.12

### Text on the board
bPlace: LED | MCU | SEN